# Altium schematic sheet Principal_Node.SchDoc: Principal_Node
size A; DrawnBy: Project_Vega_Team; Revision: 1; SheetNumber: 4; SheetTotal: 7
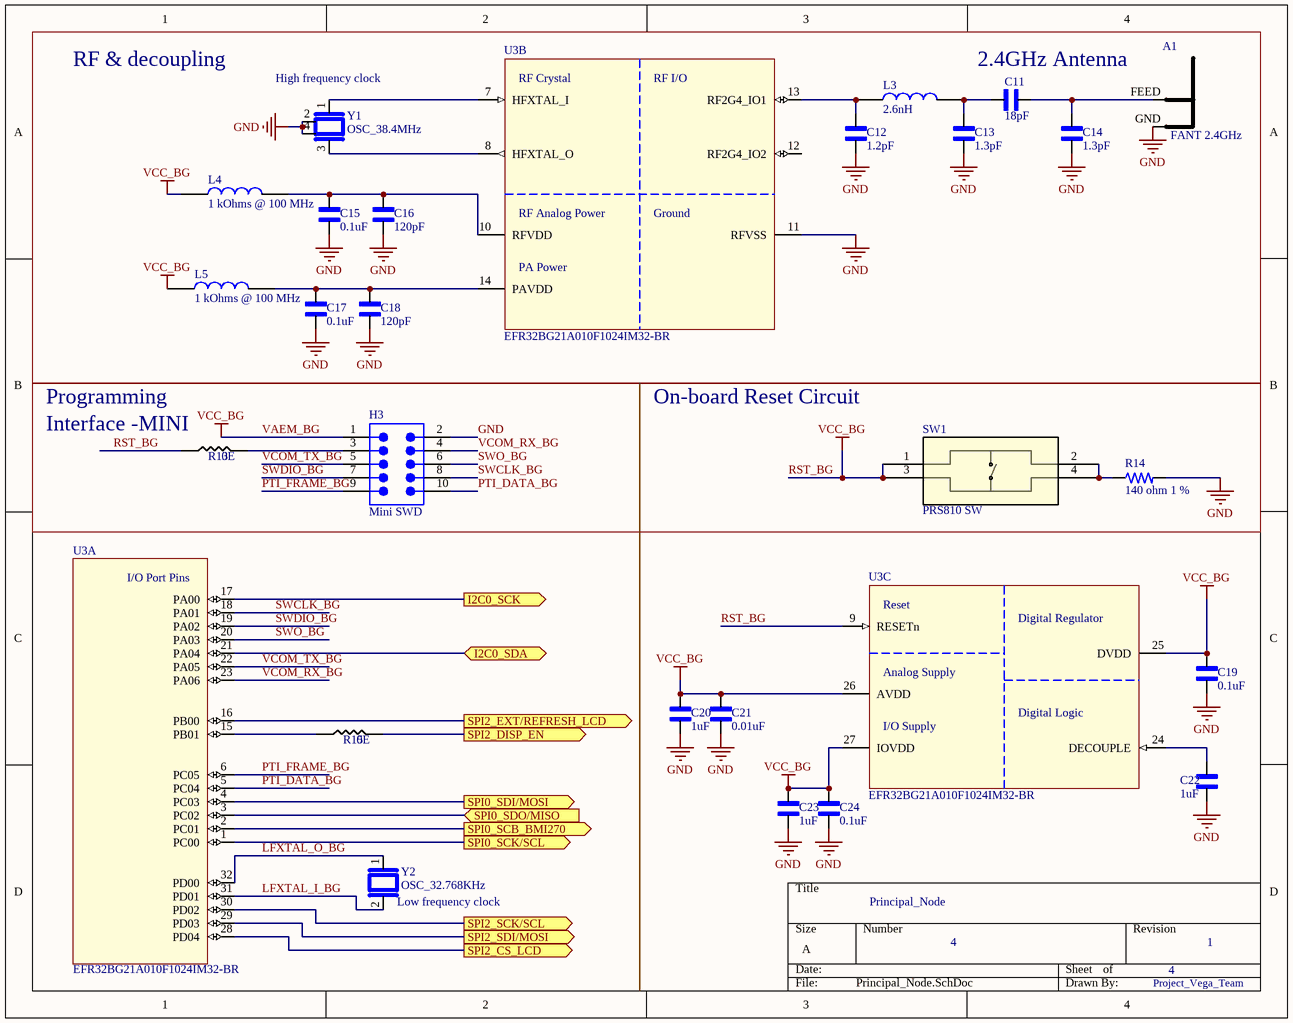
[diagram p0: Principal_Node.SchDoc]

## Parts
A1  FANT 2.4GHz  [FANT_2P4]
C11  18pF  [CAPC1608X90]
C12  1.2pF  [CAPC1608X90]
C13  1.3pF  [CAPC1608X90]
C14  1.3pF  [CAPC1608X90]
C15  0.1uF  [CAPC1608X90]
C16  120pF  [CAPC1608X90]
C17  0.1uF  [CAPC1608X90]
C18  120pF  [CAPC1608X90]
C19  0.1uF  [CAPC1608X90]
C20  1uF  [CAPC1608X90]
C21  0.01uF  [CAPC1608X90]
C22  1uF  [CAPC1608X90]
C23  1uF  [CAPC1608X90]
C24  0.1uF  [CAPC1608X90]
H3  Mini SWD  [FTSH-105-01-XXX-DV-K]
L3  2.6nH  [INDC1608X95N]
L4  1 kOhms @ 100 MHz  [INDC1608X95N]
L5  1 kOhms @ 100 MHz  [INDC1608X95N]
R13  value 0E  [1206_Passive_Resitor]  (hidden comment: 10k)
R14  140 ohm 1 %  [RES_0603_1608X06]
R15  value 0E  [1206_Passive_Resitor]  (hidden comment: 10k)
SW1  PRS810 SW  [PTS810_CNK]
U3  EFR32BG21A010F1024IM32-BR  [QFN32-EFR32xG2xIM32-BR]  (parts A,B,C of 3)  (no BOM)
Y1  OSC_38.4MHz  [OSC_38.4MHz]
Y2  OSC_32.768KHz  [OSC_32.768KHz]

## Ports
I2C0_SCK (out, see Project_Node_Sensors[2A], Project_Node_Sensors[3C]), I2C0_SDA (bidir, see Project_Node_Sensors[2A], Project_Node_Sensors[2C]), SPI0_SCB_BMI270 (out, see Project_Node_Sensors[1A]), SPI0_SCK/SCL (out, see Project_Node_Sensors[1A]), SPI0_SDI/MOSI (out, see Project_Node_Sensors[1A]), SPI0_SDO/MISO (in, see Project_Node_Sensors[1A]), SPI2_CS_LCD (out, see Project_Node_Sensors[1C]), SPI2_DISP_EN (out, see Project_Node_Sensors[1C]), SPI2_EXT/REFRESH_LCD (out, see Project_Node_Sensors[1C]), SPI2_SCK/SCL (out, see Project_Node_Sensors[1C]), SPI2_SDI/MOSI (out, see Project_Node_Sensors[1C])

## Nets
GND: A1.GND C12.2 C13.2 C14.2 C15.2 C16.2 C17.2 C18.2 C19.2 C20.2 C21.2 C22.2 C23.2 C24.2 H3.2 R14.2 U3.11(RFVSS) Y1.2 Y1.4
RST_BG: C19.1 C20.1 C21.1 C23.1 C24.1 H3.1 L4.1 L5.1 R13.1 SW1.1 SW1.3 U3.9(RESETn) U3.25(DVDD) U3.26(AVDD) U3.27(IOVDD)  [also labelled VAEM_BG, VCC_BG]
I2C0_SCK: U3.17(PA00) ; port I2C0_SCK
I2C0_SDA: U3.21(PA04) ; port I2C0_SDA
LFXTAL_I_BG: U3.31(PD01) Y2.2
LFXTAL_O_BG: U3.32(PD00) Y2.1
PTI_DATA_BG: H3.10 U3.5(PC04)
PTI_FRAME_BG: H3.9 U3.6(PC05)
SPI0_SCB_BMI270: U3.2(PC01) ; port SPI0_SCB_BMI270
SPI0_SCK/SCL: U3.1(PC00) ; port SPI0_SCK/SCL
SPI0_SDI/MOSI: U3.4(PC03) ; port SPI0_SDI/MOSI
SPI0_SDO/MISO: U3.3(PC02) ; port SPI0_SDO/MISO
SPI2_CS_LCD: U3.28(PD04) ; port SPI2_CS_LCD
SPI2_DISP_EN: R15.2 ; port SPI2_DISP_EN
SPI2_EXT/REFRESH_LCD: U3.16(PB00) ; port SPI2_EXT/REFRESH_LCD
SPI2_SCK/SCL: U3.30(PD02) ; port SPI2_SCK/SCL
SPI2_SDI/MOSI: U3.29(PD03) ; port SPI2_SDI/MOSI
SWCLK_BG: H3.8 U3.18(PA01)
SWDIO_BG: H3.7 U3.19(PA02)
SWO_BG: H3.6 U3.20(PA03)
VCOM_RX_BG: H3.4 U3.23(PA06)
VCOM_TX_BG: H3.5 U3.22(PA05)
NetA1_FEED: A1.FEED C11.2 C14.1
NetC11_1: C11.1 C13.1 L3.2
NetC12_1: C12.1 L3.1 U3.13(RF2G4_IO1)
NetC15_1: C15.1 C16.1 L4.2 U3.10(RFVDD)
NetC17_1: C17.1 C18.1 L5.2 U3.14(PAVDD)
NetC22_1: C22.1 U3.24(DECOUPLE)
NetH3_3: H3.3 R13.2
NetR14_1: R14.1 SW1.2 SW1.4
NetR15_1: R15.1 U3.15(PB01)
NetU3_7: U3.7(HFXTAL_I) Y1.1
NetU3_8: U3.8(HFXTAL_O) Y1.3

Not connected (* = marked no-connect by the designer): U3 12(RF2G4_IO2)

## Notes on the sheet
- RF & decoupling
- (near Y1) High frequency clock
- (near C11) 2.4GHz Antenna
- (near R13) Programming
- (near R13) Interface -MINI
- On-board Reset Circuit
- (near Y2) Low frequency clock
- (in symbol EFR32BG21A010F1024IM32-BR, part A) I/O Port Pins
- (in symbol EFR32BG21A010F1024IM32-BR, part B) RF Crystal; RF I/O; RF Analog Power; Ground; PA Power
- (in symbol EFR32BG21A010F1024IM32-BR, part C) Reset; Digital Regulator; Analog Supply; Digital Logic; I/O Supply

## Library data of the parts
A1 = FANT_2P4: Inverted F antenna
C11-C24 = CC0603KRX7R9BB104: 0.1 ÂµF Â±10% 50V Ceramic Capacitor X7R 0603 (1608 Metric); MF: Yageo; SnapEDA_Link: https://www.snapeda.com/parts/CC0603KRX7R9BB104/Yageo/view-part/?ref=snap; Package: 0603 Yageo; Value: *; MP: CC0603KRX7R9BB104; Check_prices: https://www.snapeda.com/parts/CC0603KRX7R9BB104/Yageo/view-part/?ref=eda
H3 = Debug Connector Mini SWD - 0.05": Mini SWD 0.05" Pitch Connector - 10 Pin SMT Box Header; Manufacturer: Adafruit Industries; Manufacturer Part Number: 4048; Supplier 1: Digi-Key; RoHS: No; Category: Connectors; Stock 1: 201; Pricing 1: 1=1.95000 (USD); ComponentLink1URL: https://media.digikey.com/pdf/Data%20Sheets/Adafruit%20PDFs/4048_Web.pdf?src-supplier=Digi-Key; ComponentLink1Description: https://media.digikey.com/pdf/Data%20Sheets/Adafruit%20PDFs/4048_Web.pdf?src-supplier=Digi-Key
L3-L5 = LQM18DN100M70L: Inductor with Inductance 10uH Tol.+/-20% Package 0603 (1608); MF: Murata Electronics; MP: LQM18DN100M70L; Price: None; SnapEDA_Link: https://www.snapeda.com/parts/LQM18DN100M70L/Murata/view-part/4834755/?ref=snap; Package: 0603 Murata; Availability: Unavailable; Value: *
R13 R15 = R_10KOhm_1206: 10 kOhms ±5% 0.25W, 1/4W Chip Resistor 1206 (3216 Metric) Automotive AEC-Q200 Thick Film; MFR Part #: RMCF1206FT10K0; Digikey Link: https://www.digikey.com/en/products/detail/stackpole-electronics-inc/RMCF1206FT10K0/1759669; LCSC Part#: C17902; Type: Basic
R14 = RC0603FR-07140RL: SMD Chip Resistor, 140 Ohm, ± 1%, 100 mW, 0603 [1608 Metric], Thick Film, General Purpose; Manufacturer: Yageo; Value: 140R; Power Rating: 100mW; Voltage Rating: 50V; Temperature Coefficient: 100ppm/°C; Supplier: Digikey; Supplier Part Number: 311-140HRCT-ND; Manufacturer Part Number: RC0603FR-07140RL; RoHS: Yes; Category: Chip SMD Resistors; Stock: 238807; Pricing: 1=0.1, 10=0.019, 50=0.0112, 100=0.0093, 500=0.00622, 1000=0.00532, 5000=0.00382, 10000=0.00335, 25000=0.00287, 35000=0.00278, 50000=0.00257, 125000=0.00232 (USD); Mounting Technology: Surface Mount; Case/Package: 0603; Case Code (Imperial): 0603; Case Code (Metric): 1608; Min Operating Temperature: -55°C; Max Operating Temperature: 155°C; Tolerance: 1%; Packaging: Tape and Reel; Termination: SMD/SMT; Voltage Rating (DC): 50V; Features: Moisture Resistant; Series: RC; Max Power Dissipation: 100mW; Number of Terminations: 2; Construction: Rectangular; Technology: THICK FILM; Length: 1.6mm; Height: 0.45mm; Depth: 0.8mm; Lead Free: Lead Free; RoHS Compliant: Yes; Military Standard: Not; ComponentLink1URL: https://datasheet.ciiva.com/11808/0900766b80c66297-11808828.pdf?src-supplier=Rs; ComponentLink1Description: https://datasheet.ciiva.com/11808/0900766b80c66297-11808828.pdf?src-supplier=Rs; ComponentLink2URL: https://datasheet.ciiva.com/15189/getdatasheetpartid-329205-15189606.pdf?src-supplier=Verical; ComponentLink2Description: https://datasheet.ciiva.com/15189/getdatasheetpartid-329205-15189606.pdf?src-supplier=Verical
SW1 = PTS810SJM250SMTRLFS: Switch Tactile N.O. SPST Button J-Bend 0.05A 16V 150000Cycles 1.569N SMD T/R; Manufacturer: ITT C&K; Actuator Color: Grey; Operating Force: 160gf; Current Rating: 50mA; Illumination Type: Non-Illuminated; Switch Travel: 0.15mm; Switch Function: Off-Mom; Number of Positions: 2; Actuator Type: Standard; Contact Resistance: 500mR; Supplier: Digikey; Supplier Part Number: CKN10502CT-ND; Manufacturer Part Number: PTS810SJM250SMTRLFS; RoHS: Yes; Stock: 130228; Pricing: 1=0.49, 10=0.474, 25=0.4568, 100=0.3954, 250=0.36028, 500=0.3339, 1000=0.29876, 2900=0.28294, 5800=0.26185, 14500=0.24428 (USD); Mounting Technology: Surface Mount; Case/Package: SMD/SMT; Pins: 4; Mechanical Life: 150000Cycles; Color: Black; Contact Plating: Silver; Min Operating Temperature: -40°C; Max Operating Temperature: 85°C; Throw Configuration: SPST; Packaging: Tape and Reel; Voltage Rating (DC): 16V; Package Quantity: 2900; Series: PTS810; Termination: J-Bend; Max Current Rating: 50mA; Orientation: Straight; Contact Current Rating: 50mA; Length: 3.2mm; Depth: 4.6mm; RoHS Compliant: Yes; Lead Free: Lead Free; ComponentLink1URL: https://datasheet.ciiva.com/24082/pts810-4mar13-248115-24082262.pdf?src-supplier=Mouser; ComponentLink1Description: https://datasheet.ciiva.com/24082/pts810-4mar13-248115-24082262.pdf?src-supplier=Mouser; ComponentLink2URL: https://datasheet.ciiva.com/18514/pts810-4mar13-18514058.pdf?src-supplier=Digikey; ComponentLink2Description: https://datasheet.ciiva.com/18514/pts810-4mar13-18514058.pdf?src-supplier=Digikey; ComponentLink3URL: https://datasheet.ciiva.com/18514/pts810-4mar13-18514059.pdf?src-supplier=Digikey; ComponentLink3Description: https://datasheet.ciiva.com/18514/pts810-4mar13-18514059.pdf?src-supplier=Digikey; ComponentLink4URL: https://datasheet.ciiva.com/18514/pts810-4mar13-18514060.pdf?src-supplier=Digikey; ComponentLink4Description: https://datasheet.ciiva.com/18514/pts810-4mar13-18514060.pdf?src-supplier=Digikey
U3 = EFR32BG21A010F1024IM32-BR: Blue Gecko, QFN32, 2.4G, 10dB, Bluetooth 5.1, 1024kB, 96kB(RAM), 20 GPIO; Manufacturer: Silicon Labs; Supplier: Digikey; Supplier Part Number: 336-5869-1-ND; Manufacturer Part Number: EFR32BG21A010F1024IM32-BR; RoHS: No; Category: RF Receivers, Transceivers; Stock: 38892; Pricing: 1=4.27, 10=3.816, 25=3.4348, 100=3.1293, 250=2.82404, 500=2.6875 (USD); ComponentLink1URL: https://www.silabs.com/documents/login/data-sheets/efr32bg21-datasheet.pdf?src-supplier=Digikey; ComponentLink1Description: https://www.silabs.com/documents/login/data-sheets/efr32bg21-datasheet.pdf?src-supplier=Digikey; ComponentLink2URL: https://datasheet.octopart.com/EFR32BG21A010F1024IM32-BR-Silicon-Labs-datasheet-142046433.pdf?src-supplier=Arrow.cn; ComponentLink2Description: https://datasheet.octopart.com/EFR32BG21A010F1024IM32-BR-Silicon-Labs-datasheet-142046433.pdf?src-supplier=Arrow.cn
Y1 = OSC_38.4MHz: 38.4 MHz ±10ppm Crystal 10pF 40 Ohms 4-SMD, No Lead; MF: {'manufacturer': u'Murata Electronics'}; MP: XRCGB38M400F2P00R0; Package: None; Price: None; Value: *; Availability: Unavailable; Supplier 1: Digikey; Supplier Part Number 1: 4606-TZ3398BCT-ND
Y2 = OSC_32.768KHz: Tuning Fork Crystal 32.768kHz in 1.2 x 2.0mm package; MF: Micro Crystal; MP: CM8V-T1A-32.768KHZ-7PF-20PPM-TA-QC; Package: SMD-2 Micro Crystal; Price: None; Value: *; SnapEDA_Link: https://www.snapeda.com/parts/CM8V-T1A-32.768KHZ-7PF-20PPM-TA-QC/Micro+Crystal/view-part/?ref=snap; Availability: Not in stock; Check_prices: https://www.snapeda.com/parts/CM8V-T1A-32.768KHZ-7PF-20PPM-TA-QC/Micro+Crystal/view-part/?ref=eda; Supplier 1: Digikey; Supplier Part Number 1: 2195-CM8V-T1A-32.768KHZ-7PF-20PPM-TA-QCCT-ND